# Altium project Sample_holder.PrjPcb
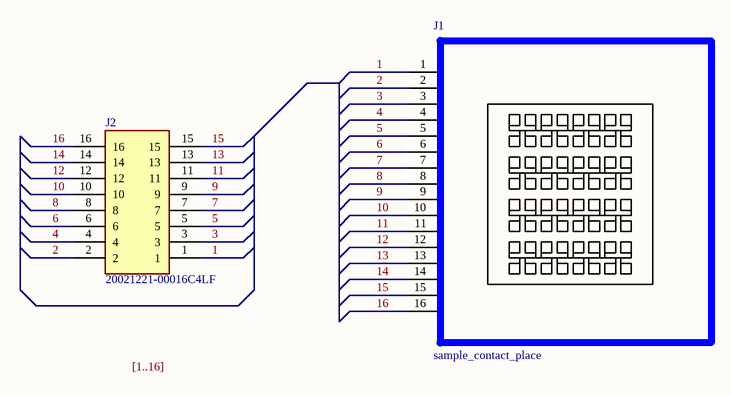
[diagram p0: Schematic-16pin.SchDoc]
1 sheet, 2 parts. Net scope: global (net labels, ports and power ports of the same name join across sheets).
Board files: PCB_panelized.PcbDoc, PCB_Minitek127-16pin.PcbDoc

## Sheet Schematic-16pin.SchDoc
size A4

### Parts
J1  sample_contact_place  [sample]
J2  20021221-00016C4LF  [2002122100016C4LF]

### Nets
1: J1.1 J2.1
2: J1.2 J2.2
3: J1.3 J2.3
4: J1.4 J2.4
5: J1.5 J2.5
6: J1.6 J2.6
7: J1.7 J2.7
8: J1.8 J2.8
9: J1.9 J2.9
10: J1.10 J2.10
11: J1.11 J2.11
12: J1.12 J2.12
13: J1.13 J2.13
14: J1.14 J2.14
15: J1.15 J2.15
16: J1.16 J2.16

### Buses and harness runs
bus [1..16]

### Notes on the sheet
- Labels drawn without touching a wire or pin: [1..16]

### Library data of the parts
J2 = 20021221-00016C4LF: Connector; Manufacturer_Name: Amphenol; Height: 5.8mm; Manufacturer_Part_Number: 20021221-00016C4LF